# Altium project HAB-Altitude-Dynamics-Control-Card.PrjPcb (part 3 of 4)

## Sheet Power-Supplies.SchDoc: Payload Card 5V Rail Power Supplies
size A2; Revision: 1A; SheetNumber: 6; SheetTotal: 7; Organization: Brickworks; Address1: Matthew Glazer; Address2: Design Engineer
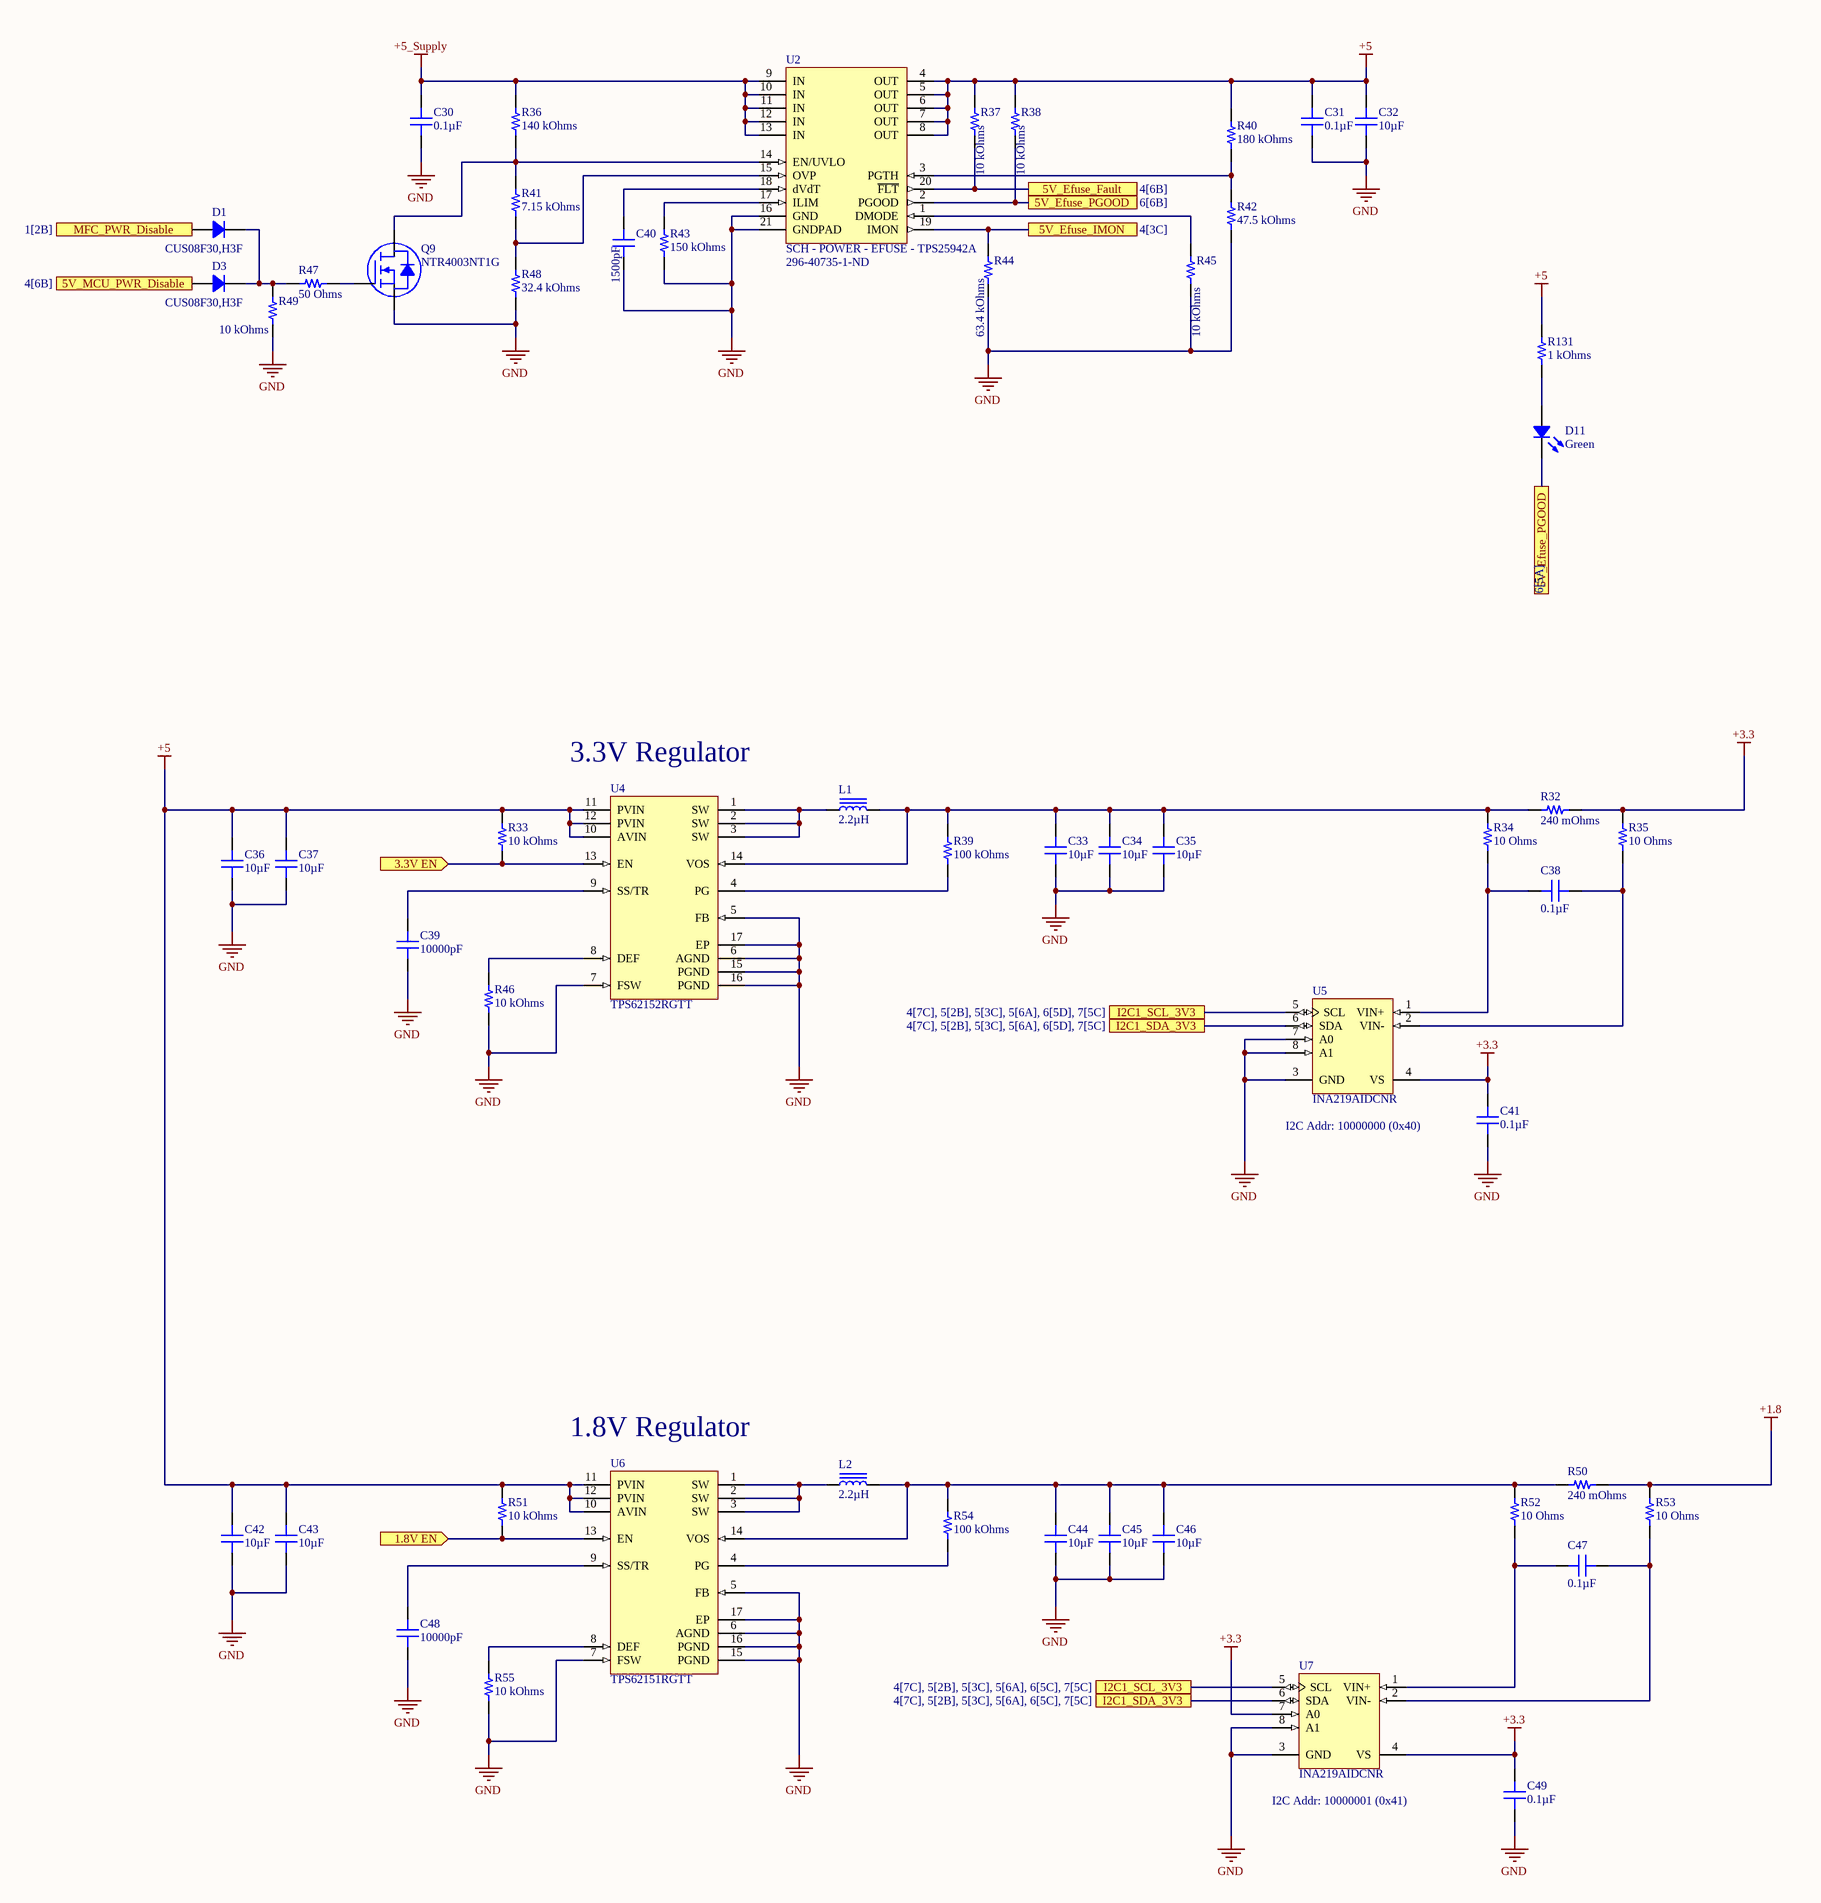
[diagram p5: Power-Supplies.SchDoc]

### Parts
C30  0.1µF  [CAP 0603_1608]
C31  0.1µF  [CAP 0603_1608]
C32  10µF  [CAP 0805_2012]
C33  10µF  [CAP 0805_2012]
C34  10µF  [CAP 0805_2012]
C35  10µF  [CAP 0805_2012]
C36  10µF  [CAP 0805_2012]
C37  10µF  [CAP 0805_2012]
C38  0.1µF  [CAP 0603_1608]
C39  10000pF  [CAP 0603_1608]
C40  1500pF  [CAP 0603_1608]
C41  0.1µF  [CAP 0603_1608]
C42  10µF  [CAP 0805_2012]
C43  10µF  [CAP 0805_2012]
C44  10µF  [CAP 0805_2012]
C45  10µF  [CAP 0805_2012]
C46  10µF  [CAP 0805_2012]
C47  0.1µF  [CAP 0603_1608]
C48  10000pF  [CAP 0603_1608]
C49  0.1µF  [CAP 0603_1608]
D1  CUS08F30,H3F  [SOD323]
D3  CUS08F30,H3F  [SOD323]
D11  Green  [LED 0603_1608 GREEN]
L1  2.2µH  [BOURNS SRN4018]
L2  2.2µH  [BOURNS SRN4018]
Q9  NTR4003NT1G  [ON SEMI SOT-23-3]
R32  240 mOhms  [RES 0805_2012]
R33  10 kOhms  [RES 0603_1608]
R34  10 Ohms  [RES 0603_1608]
R35  10 Ohms  [RES 0603_1608]
R36  140 kOhms  [RES 0603_1608]
R37  10 kOhms  [RES 0603_1608]
R38  10 kOhms  [RES 0603_1608]
R39  100 kOhms  [RES 0603_1608]
R40  180 kOhms  [RES 0603_1608]
R41  7.15 kOhms  [RES 0603_1608]
R42  47.5 kOhms  [RES 0603_1608]
R43  150 kOhms  [RES 0603_1608]
R44  63.4 kOhms  [RES 0603_1608]
R45  10 kOhms  [RES 0603_1608]
R46  10 kOhms  [RES 0603_1608]
R47  50 Ohms  [RES 0603_1608]
R48  32.4 kOhms  [RES 0603_1608]
R49  10 kOhms  [RES 0603_1608]
R50  240 mOhms  [RES 0805_2012]
R51  10 kOhms  [RES 0603_1608]
R52  10 Ohms  [RES 0603_1608]
R53  10 Ohms  [RES 0603_1608]
R54  100 kOhms  [RES 0603_1608]
R55  10 kOhms  [RES 0603_1608]
R131  1 kOhms  [RES 0603_1608]
U2  SCH - POWER - EFUSE - TPS25942A  Supplier Part Number 1: 296-40735-1-ND  [PCB - LEADLESS - QFN - TI 20-WQFN]
U4  TPS62152RGTT  [RGT0016C_V]
U5  INA219AIDCNR  [DCN0008A_M]
U6  TPS62151RGTT  [RGT0016C_V]
U7  INA219AIDCNR  [DCN0008A_M]

### Ports
1.8V EN (in), 3.3V EN (in), 5V_Efuse_Fault (see 4[6B]), 5V_Efuse_IMON (see 4[3C]), 5V_Efuse_PGOOD (see 6[5A]), 5V_Efuse_PGOOD (see 6[6B]), 5V_MCU_PWR_Disable (in, see 4[6B]), I2C1_SCL_3V3 (see 4[7C], 5[2B], 5[3C], 5[6A], 6[5C], 7[5C]), I2C1_SCL_3V3 (see 4[7C], 5[2B], 5[3C], 5[6A], 6[5D], 7[5C]), I2C1_SDA_3V3 (see 4[7C], 5[2B], 5[3C], 5[6A], 6[5C], 7[5C]), I2C1_SDA_3V3 (see 4[7C], 5[2B], 5[3C], 5[6A], 6[5D], 7[5C]), MFC_PWR_Disable (in, see 1[2B])

### Nets
+1.8: R50.2 R53.2
+3.3: C41.2 C49.2 R32.2 R35.2 U5.4(VS) U7.4(VS) U7.7(A0)
+5: C31.2 C32.2 C36.2 C37.2 C42.2 C43.2 R33.2 R37.2 R38.2 R40.2 R51.2 R131.1 U2.4(OUT) U2.5(OUT) U2.6(OUT) U2.7(OUT) U2.8(OUT) U4.10(AVIN) U4.11(PVIN) U4.12(PVIN) U6.10(AVIN) U6.11(PVIN) U6.12(PVIN)
+5_Supply: C30.2 R36.2 U2.9(IN) U2.10(IN) U2.11(IN) U2.12(IN) U2.13(IN)
GND: C30.1 C31.1 C32.1 C33.1 C34.1 C35.1 C36.1 C37.1 C39.1 C40.1 C41.1 C42.1 C43.1 C44.1 C45.1 C46.1 C48.1 C49.1 Q9.2(S) R42.1 R43.1 R44.1 R45.1 R46.1 R48.1 R49.1 R55.1 U2.16(GND) U2.21(GNDPAD) U4.5(FB) U4.6(AGND) U4.7(FSW) U4.15(PGND) U4.16(PGND) U4.17(EP) U5.3(GND) U5.7(A0) U5.8(A1) U6.5(FB) U6.6(AGND) U6.7(FSW) U6.15(PGND) U6.16(PGND) U6.17(EP) U7.3(GND) U7.8(A1)
NetC33_2: C33.2 C34.2 C35.2 L1.2 R32.1 R34.2 R39.2 U4.14(VOS)
NetC38_1: C38.1 R35.1 U5.2(VIN-)
NetC38_2: C38.2 R34.1 U5.1(VIN+)
NetC39_2: C39.2 U4.9(SS/TR)
NetC40_2: C40.2 U2.18(dVdT)
NetC44_2: C44.2 C45.2 C46.2 L2.2 R50.1 R52.2 R54.2 U6.14(VOS)
NetC47_1: C47.1 R53.1 U7.2(VIN-)
NetC47_2: C47.2 R52.1 U7.1(VIN+)
NetC48_2: C48.2 U6.9(SS/TR)
NetD1_1: D1.1 ; port MFC_PWR_Disable
NetD1_2: D1.2 D3.2 R47.2 R49.2
NetD3_1: D3.1 ; port 5V_MCU_PWR_Disable
NetD11_1: D11.1 R131.2
NetD11_2: D11.2 R38.1 U2.2(PGOOD) ; port 5V_Efuse_PGOOD
NetL1_1: L1.1 U4.1(SW) U4.2(SW) U4.3(SW)
NetL2_1: L2.1 U6.1(SW) U6.2(SW) U6.3(SW)
NetQ9_1: Q9.1(G) R47.1
NetQ9_3: Q9.3(D) R36.1 R41.2 U2.14(EN/UVLO)
NetR29_1: U5.5(SCL) U7.5(SCL) ; port I2C1_SCL_3V3
NetR30_1: U5.6(SDA) U7.6(SDA) ; port I2C1_SDA_3V3
NetR33_1: R33.1 U4.13(EN) ; port 3.3V EN
NetR37_1: R37.1 U2.20(~{FLT}) ; port 5V_Efuse_Fault
NetR39_1: R39.1 U4.4(PG)
NetR40_1: R40.1 R42.2 U2.3(PGTH)
NetR41_1: R41.1 R48.2 U2.15(OVP)
NetR43_2: R43.2 U2.17(ILIM)
NetR44_2: R44.2 U2.19(IMON) ; port 5V_Efuse_IMON
NetR45_2: R45.2 U2.1(DMODE)
NetR46_2: R46.2 U4.8(DEF)
NetR51_1: R51.1 U6.13(EN) ; port 1.8V EN
NetR54_1: R54.1 U6.4(PG)
NetR55_2: R55.2 U6.8(DEF)

### Notes on the sheet
- (near U4) 3.3V Regulator
- I2C Addr: 10000000 (0x40)
- (near U6) 1.8V Regulator
- (near U7) I2C Addr: 10000001 (0x41)
- Title
- Size:
- Date:
- File:
- A2
- Number:
- Time:
- Revision:
- Sheet
- of

### Library data of the parts
C30 C31 C38 C41 C47 C49 = CL10B104KA8WPNC: CAP CER 0.1UF 25V X7R 0603; Manufacturer: Samsung Electro-Mechanics; Tolerance: ±10%; Part Number: CL10B104KA8WPNC; Value: 0.1µF; Applications: Automotive; Capacitance: 0.1µF; ComponentLink1Description: Datasheet; ComponentLink1URL: http://www.samsungsem.com/kr/support/product-search/mlcc/CL10B104KA8WPNC.jsp; ComponentLink2Description: DigiKey Link; ComponentLink2URL: http://digikey.com/product-detail/en/samsung-electro-mechanics/CL10B104KA8WPNC/1276-6717-1-ND/5961576; Device Package: 0603 (1608 Metric); Features: Open Mode; LastUpdated: 9/2/2020 1:03:30 AM; Lifecycle Status: Active; Minimum Order: 1; Mounting Type: Surface Mount, MLCC; Operating Temperature: -55°C ~ 125°C; Package / Case: 0603 (1608 Metric); Packaging: TapeAndReel; PartId: 5631; Part Status: Active; Price: 0.02; Ratings: AEC-Q200; Series: CL; Size / Dimension: 0.063" L x 0.031" W (1.60mm x 0.80mm); Supplier 1: DigiKey; Supplier Part Number 1: 1276-6717-1-ND; Temperature Coefficient: X7R; Thickness (Max): 0.035" (0.90mm); Voltage - Rated: 25V
C32-C37 C42-C46 = CC0805KKX5R7BB106: CAP CER 10UF 16V X5R 0805; Manufacturer: Yageo; Tolerance: ±10%; Part Number: CC0805KKX5R7BB106; Value: 10µF; Applications: General Purpose; Capacitance: 10µF; ComponentLink1Description: Datasheet; ComponentLink1URL: https://www.yageo.com/upload/media/product/productsearch/datasheet/mlcc/UPY-GPHC_X5R_4V-to-50V_25.pdf; ComponentLink2Description: DigiKey Link; ComponentLink2URL: http://digikey.com/product-detail/en/yageo/CC0805KKX5R7BB106/311-1865-1-ND/5195767; Device Package: 0805 (2012 Metric); LastUpdated: 9/2/2020 1:04:30 AM; Lifecycle Status: Active; Minimum Order: 1; Mounting Type: Surface Mount, MLCC; Operating Temperature: -55°C ~ 85°C; Package / Case: 0805 (2012 Metric); Packaging: TapeAndReel; PartId: 8867; Part Status: Active; Price: 0.09; Series: CC; Size / Dimension: 0.079" L x 0.049" W (2.00mm x 1.25mm); Supplier 1: DigiKey; Supplier Part Number 1: 311-1865-1-ND; Temperature Coefficient: X5R; Thickness (Max): 0.057" (1.45mm); Voltage - Rated: 16V
C39 C48 = C0603S103K4RACTU: CAP CER 10000PF 16V X7R 0603; Manufacturer: KEMET; Tolerance: ±10%; Part Number: C0603S103K4RACTU; Value: 10000pF; Applications: Boardflex Sensitive; Capacitance: 10000pF; ComponentLink1Description: Datasheet; ComponentLink1URL: https://api.kemet.com/component-edge/download/datasheet/C0603S103K4RACTU.pdf; ComponentLink2Description: DigiKey Link; ComponentLink2URL: http://digikey.com/product-detail/en/kemet/C0603S103K4RACTU/399-9135-1-ND/3522653; Device Package: 0603 (1608 Metric); Features: Floating Electrode; LastUpdated: 9/2/2020 1:03:34 AM; Lifecycle Status: Active; Minimum Order: 1; Mounting Type: Surface Mount, MLCC; Operating Temperature: -55°C ~ 125°C; Package / Case: 0603 (1608 Metric); Packaging: TapeAndReel; PartId: 3312; Part Status: Active; Price: 0.07; Series: SMD Comm X7R FE; Size / Dimension: 0.063" L x 0.031" W (1.60mm x 0.80mm); Supplier 1: DigiKey; Supplier Part Number 1: 399-9135-1-ND; Temperature Coefficient: X7R; Thickness (Max): 0.034" (0.87mm); Voltage - Rated: 16V
C40 = CC0603JRX7R8BB152: CAP CER 1500PF 25V X7R 0603; Manufacturer: Yageo; Tolerance: ±5%; Part Number: CC0603JRX7R8BB152; Value: 1500pF; Applications: General Purpose; Capacitance: 1500pF; ComponentLink1Description: Datasheet; ComponentLink1URL: https://www.yageo.com/upload/media/product/productsearch/datasheet/mlcc/UPY-GPHC_X7R_6.3V-to-50V_18.pdf; ComponentLink2Description: DigiKey Link; ComponentLink2URL: http://digikey.com/product-detail/en/yageo/CC0603JRX7R8BB152/311-3996-1-ND/8025085; Device Package: 0603 (1608 Metric); LastUpdated: 9/2/2020 1:03:18 AM; Lifecycle Status: Active; Minimum Order: 1; Mounting Type: Surface Mount, MLCC; Operating Temperature: -55°C ~ 125°C; Package / Case: 0603 (1608 Metric); Packaging: TapeAndReel; PartId: 12307; Part Status: Active; Price: 0.02; Series: CC; Size / Dimension: 0.063" L x 0.031" W (1.60mm x 0.80mm); Supplier 1: DigiKey; Supplier Part Number 1: 311-3996-1-ND; Temperature Coefficient: X7R; Thickness (Max): 0.035" (0.90mm); Voltage - Rated: 25V
D1 D3 = CUS08F30,H3F: DIODE SCHOTTKY 30V 800MA USC; Manufacturer: Toshiba Semiconductor and Storage; Current - Reverse Leakage @ Vr: 50µA @ 30V; Speed: Fast Recovery =< 500ns, > 200mA (Io); Voltage - Forward (Vf) (Max) @ If: 220mV @ 10mA; Part Number: CUS08F30,H3F; ComponentLink1Description: Datasheet; ComponentLink1URL: https://toshiba.semicon-storage.com/info/docget.jsp?did=9019&prodName=CUS08F30; ComponentLink2Description: DigiKey Link; ComponentLink2URL: http://digikey.com/product-detail/en/toshiba-semiconductor-and-storage/CUS08F30H3F/CUS08F30H3FCT-ND/5114376; Current - Average Rectified (Io): 800mA; Diode Type: Schottky; LastUpdated: 9/2/2020 1:27:26 AM; Lifecycle Status: Active; Minimum Order: 1; Mounting Type: Surface Mount; Operating Temperature - Junction: 125°C (Max); Package / Case: SC-76, SOD-323; Packaging: TapeAndReel; PartId: 3013; Part Status: Active; Price: 0.06; Series: -; Supplier 1: DigiKey; Supplier Part Number 1: CUS08F30H3FCT-ND; Supplier Device Package: USC; Voltage - DC Reverse (Vr) (Max): 30V
D11 = LTST-C193KGKT-5A: LED GREEN CLEAR CHIP SMD; Manufacturer: Lite-On Inc.; Configuration: Standard; Current - Test: 5mA; Lens Color: Colorless; Lens Size: 1.15mm x 0.80mm; Lens Style: Rectangle with Flat Top; Millicandela Rating: 16.25mcd; Viewing Angle: 130°; Voltage - Forward (Vf) (Typ): 2V; Wavelength - Dominant: 572nm; Wavelength - Peak: 574nm; Part Number: LTST-C193KGKT-5A; Color: Green; ComponentLink1Description: Datasheet; ComponentLink1URL: http://optoelectronics.liteon.com/upload/download/DS22-2007-0094/LTST-C193KGKT-5A.PDF; ComponentLink2Description: DigiKey Link; ComponentLink2URL: http://digikey.com/product-detail/en/lite-on-inc/LTST-C193KGKT-5A/160-1828-1-ND/2356247; Device Package: 0603 (1608 Metric); Height (Max): 0.45mm; LastUpdated: 9/2/2020 1:20:41 AM; Lens Transparency: Clear; Lifecycle Status: Active; Minimum Order: 1; Mounting Type: Surface Mount; Package / Case: 0603 (1608 Metric); Packaging: TapeAndReel; PartId: 694; Part Status: Active; Price: 0.06; Series: -; Size / Dimension: 1.60mm L x 0.80mm W; Supplier 1: DigiKey; Supplier Part Number 1: 160-1828-1-ND; Supplier Device Package: Chip LED; Value: Green
L1 L2 = SRN4018-2R2M: FIXED IND 2.2UH 2.9A 44 MOHM SMD; Manufacturer: Bourns Inc.; Current - Saturation: 3A; DC Resistance (DCR): 44mOhm Max; Frequency - Self Resonant: 60MHz; Inductance Frequency - Test: 100kHz; Material - Core: Ferrite; Q @ Freq: 9 @ 7.96MHz; Shielding: Semi-Shielded; Tolerance: ±20%; Type: Wirewound; Part Number: SRN4018-2R2M; ComponentLink1Description: Datasheet; ComponentLink1URL: https://www.bourns.com/docs/Product-Datasheets/SRN4018.pdf; ComponentLink2Description: DigiKey Link; ComponentLink2URL: http://digikey.com/product-detail/en/bourns-inc/SRN4018-2R2M/SRN4018-2R2MCT-ND/3821517; Current Rating (Amps): 2.9A; Device Package: Nonstandard; Height - Seated (Max): 0.071" (1.80mm); Inductance: 2.2µH; LastUpdated: 9/2/2020 1:30:23 AM; Lifecycle Status: Active; Minimum Order: 1; Mounting Type: Surface Mount; Operating Temperature: -40°C ~ 125°C; Package / Case: Nonstandard; Packaging: TapeAndReel; PartId: 3660; Part Status: Active; Price: 0.16; Series: SRN4018; Size / Dimension: 0.157" L x 0.157" W (4.00mm x 4.00mm); Supplier 1: DigiKey; Supplier Part Number 1: SRN4018-2R2MCT-ND; Value: 2.2µH
Q9 = NTR4003NT1G: MOSFET N-CH 30V 500MA SOT-23; Manufacturer: ON Semiconductor; Current - Continuous Drain (Id) @ 25°C: 500mA (Ta); Drive Voltage (Max Rds On,  Min Rds On): 2.5V, 4V; FET Type: N-Channel; Gate Charge (Qg) (Max) @ Vgs: 1.15nC @ 5V; Input Capacitance (Ciss) (Max) @ Vds: 21pF @ 5V; Power Dissipation (Max): 690mW (Ta); Rds On (Max) @ Id, Vgs: 1.5Ohm @ 10mA, 4V; Vgs (Max): ±20V; Vgs(th) (Max) @ Id: 1.4V @ 250µA; Part Number: NTR4003NT1G; ComponentLink1Description: Datasheet; ComponentLink1URL: http://www.onsemi.com/pub/Collateral/NTR4003N-D.PDF; ComponentLink2Description: DigiKey Link; ComponentLink2URL: http://digikey.com/product-detail/en/on-semiconductor/NTR4003NT1G/NTR4003NT1GOSCT-ND/1967270; Drain to Source Voltage (Vdss): 30V; LastUpdated: 9/2/2020 1:25:08 AM; Lifecycle Status: Active; Minimum Order: 1; Mounting Type: Surface Mount; Operating Temperature: -55°C ~ 150°C (TJ); Package / Case: TO-236-3, SC-59, SOT-23-3; Packaging: TapeAndReel; Part Status: Active; Price: 0.05; Series: -; Supplier 1: DigiKey; Supplier Part Number 1: NTR4003NT1GOSCT-ND; Supplier Device Package: SOT-23-3 (TO-236); Technology: MOSFET (Metal Oxide)
R32 R50 = ERJ-6DQFR24V: RES 0.24 OHM 1% 1/2W 0805; Manufacturer: Panasonic Electronic Components; Power (Watts): 0.5W, 1/2W; Temperature Coefficient: ±100ppm/°C; Part Number: ERJ-6DQFR24V; Value: 240 mOhms; ComponentLink1Description: Datasheet; ComponentLink1URL: https://industrial.panasonic.com/cdbs/www-data/pdf/RDN0000/AOA0000C313.pdf; ComponentLink2Description: DigiKey Link; ComponentLink2URL: http://digikey.com/product-detail/en/panasonic-electronic-components/ERJ-6DQFR24V/P19293CT-ND/6004648; Composition: Thick Film; Device Package: 0805 (2012 Metric); Features: Automotive AEC-Q200, Current Sense; Height - Seated (Max): 0.028" (0.70mm); LastUpdated: 9/2/2020 1:14:59 AM; Lifecycle Status: Active; Minimum Order: 1; Number of Terminations: 2; Operating Temperature: -55°C ~ 155°C; Package / Case: 0805 (2012 Metric); Packaging: TapeAndReel; PartId: 39224; Part Status: Active; Price: 0.04; Ratings: AEC-Q200; Resistance: 240 mOhms; Series: ERJ; Size / Dimension: 0.079" L x 0.049" W (2.00mm x 1.25mm); Supplier 1: DigiKey; Supplier Part Number 1: P19293CT-ND; Supplier Device Package: 0805; Tolerance: ±1%
R33 R37 R38 R45 R46 R49 R51 R55 = RMCF0603JT10K0: RES 10K OHM 5% 1/10W 0603; Manufacturer: Stackpole Electronics Inc; Power (Watts): 0.1W, 1/10W; Temperature Coefficient: ±200ppm/°C; Part Number: RMCF0603JT10K0; Value: 10 kOhms; ComponentLink1Description: Datasheet; ComponentLink1URL: https://www.seielect.com/catalog/sei-packaging.pdf; ComponentLink2Description: DigiKey Link; ComponentLink2URL: http://digikey.com/product-detail/en/stackpole-electronics-inc/RMCF0603JT10K0/RMCF0603JT10K0CT-ND/1943191; Composition: Thick Film; Device Package: 0603 (1608 Metric); Features: Automotive AEC-Q200; Height - Seated (Max): 0.022" (0.55mm); LastUpdated: 8/30/2020 8:48:45 PM; Lifecycle Status: Active; Minimum Order: 1; Number of Terminations: 2; Operating Temperature: -55°C ~ 155°C; Package / Case: 0603 (1608 Metric); Packaging: CutTape; PartId: 25659; Part Status: Active; Price: 0.10; Ratings: AEC-Q200; Resistance: 10 kOhms; Series: RMCF; Size / Dimension: 0.061" L x 0.031" W (1.55mm x 0.80mm); Supplier 1: DigiKey; Supplier Part Number 1: RMCF0603JT10K0CT-ND; Supplier Device Package: 0603; Tolerance: ±5%
R34 R35 R52 R53 = CRGCQ0603F10R: CRGCQ 0603 10R 1%; Manufacturer: TE Connectivity Passive Product; Power (Watts): 0.1W, 1/10W; Temperature Coefficient: ±400ppm/°C; Part Number: CRGCQ0603F10R; Value: 10 Ohms; ComponentLink1Description: Datasheet; ComponentLink1URL: https://www.te.com/commerce/DocumentDelivery/DDEController?Action=srchrtrv&DocNm=1773204-3&DocType=DS&DocLang=English; ComponentLink2Description: DigiKey Link; ComponentLink2URL: http://digikey.com/product-detail/en/te-connectivity-passive-product/CRGCQ0603F10R/A129664CT-ND/8577496; Composition: Thick Film; Device Package: 0603 (1608 Metric); Features: Automotive AEC-Q200, Moisture Resistant; Height - Seated (Max): 0.022" (0.55mm); LastUpdated: 9/2/2020 1:09:39 AM; Lifecycle Status: Active; Minimum Order: 1; Number of Terminations: 2; Operating Temperature: -55°C ~ 155°C; Package / Case: 0603 (1608 Metric); Packaging: CutTape; PartId: 23975; Part Status: Active; Price: 0.10; Ratings: AEC-Q200; Resistance: 10 Ohms; Series: CRGCQ; Size / Dimension: 0.063" L x 0.031" W (1.60mm x 0.80mm); Supplier 1: DigiKey; Supplier Part Number 1: A129664CT-ND; Supplier Device Package: 0603; Tolerance: ±1%
R36 = RT0603BRE07140KL: RES SMD 140K OHM 0.1% 1/10W 0603; Manufacturer: Yageo; Power (Watts): 0.1W, 1/10W; Temperature Coefficient: ±50ppm/°C; Part Number: RT0603BRE07140KL; Value: 140 kOhms; ComponentLink1Description: Datasheet; ComponentLink1URL: https://www.yageo.com/upload/media/product/productsearch/datasheet/rchip/PYu-RT_1-to-0.01_RoHS_L_11.pdf; ComponentLink2Description: DigiKey Link; ComponentLink2URL: http://digikey.com/product-detail/en/yageo/RT0603BRE07140KL/YAG4626CT-ND/6616782; Composition: Thin Film; Device Package: 0603 (1608 Metric); Height - Seated (Max): 0.022" (0.55mm); LastUpdated: 9/2/2020 1:09:47 AM; Lifecycle Status: Active; Minimum Order: 1; Number of Terminations: 2; Operating Temperature: -55°C ~ 155°C; Package / Case: 0603 (1608 Metric); Packaging: TapeAndReel; PartId: 22168; Part Status: Active; Price: 0.05; Resistance: 140 kOhms; Series: RT; Size / Dimension: 0.063" L x 0.031" W (1.60mm x 0.80mm); Supplier 1: DigiKey; Supplier Part Number 1: YAG4626CT-ND; Supplier Device Package: 0603; Tolerance: ±0.1%
R39 R54 = RC0603JR-10100KL: RES SMD 100K OHM 5% 1/10W 0603; Manufacturer: Yageo; Power (Watts): 0.1W, 1/10W; Temperature Coefficient: ±100ppm/°C; Part Number: RC0603JR-10100KL; Value: 100 kOhms; ComponentLink1Description: Datasheet; ComponentLink1URL: https://www.yageo.com/upload/media/product/productsearch/datasheet/rchip/PYu-RC_Group_51_RoHS_L_10.pdf; ComponentLink2Description: DigiKey Link; ComponentLink2URL: http://digikey.com/product-detail/en/yageo/RC0603JR-10100KL/YAG2294CT-ND/5252408; Composition: Thick Film; Device Package: 0603 (1608 Metric); Features: Moisture Resistant; Height - Seated (Max): 0.022" (0.55mm); LastUpdated: 9/2/2020 1:10:22 AM; Lifecycle Status: Active; Minimum Order: 1; Number of Terminations: 2; Operating Temperature: -55°C ~ 155°C; Package / Case: 0603 (1608 Metric); Packaging: CutTape; PartId: 6071; Part Status: Active; Price: 0.10; Resistance: 100 kOhms; Series: RC; Size / Dimension: 0.063" L x 0.031" W (1.60mm x 0.80mm); Supplier 1: DigiKey; Supplier Part Number 1: YAG2294CT-ND; Supplier Device Package: 0603; Tolerance: ±5%
R40 = RMCF0603FT180K: RES 180K OHM 1% 1/10W 0603; Manufacturer: Stackpole Electronics Inc; Power (Watts): 0.1W, 1/10W; Temperature Coefficient: ±100ppm/°C; Part Number: RMCF0603FT180K; Value: 180 kOhms; ComponentLink1Description: Datasheet; ComponentLink1URL: https://www.seielect.com/catalog/sei-rmcf_rmcp.pdf; ComponentLink2Description: DigiKey Link; ComponentLink2URL: http://digikey.com/product-detail/en/stackpole-electronics-inc/RMCF0603FT180K/RMCF0603FT180KCT-ND/5049744; Composition: Thick Film; Device Package: 0603 (1608 Metric); Features: Automotive AEC-Q200; Height - Seated (Max): 0.022" (0.55mm); LastUpdated: 9/2/2020 1:10:00 AM; Lifecycle Status: Active; Minimum Order: 1; Number of Terminations: 2; Operating Temperature: -55°C ~ 155°C; Package / Case: 0603 (1608 Metric); Packaging: CutTape; PartId: 16499; Part Status: Active; Price: 0.10; Ratings: AEC-Q200; Resistance: 180 kOhms; Series: RMCF; Size / Dimension: 0.061" L x 0.031" W (1.55mm x 0.80mm); Supplier 1: DigiKey; Supplier Part Number 1: RMCF0603FT180KCT-ND; Supplier Device Package: 0603; Tolerance: ±1%
R41 = ERJ-PB3B7151V: RES SMD 7.15K OHM 0.1% 1/5W 0603; Manufacturer: Panasonic Electronic Components; Power (Watts): 0.2W, 1/5W; Temperature Coefficient: ±50ppm/°C; Part Number: ERJ-PB3B7151V; Value: 7.15 kOhms; ComponentLink1Description: Datasheet; ComponentLink1URL: https://industrial.panasonic.com/cdbs/www-data/pdf/RDM0000/AOA0000C328.pdf; ComponentLink2Description: DigiKey Link; ComponentLink2URL: http://digikey.com/product-detail/en/panasonic-electronic-components/ERJ-PB3B7151V/P20070CT-ND/6214325; Composition: Thick Film; Device Package: 0603 (1608 Metric); Features: Automotive AEC-Q200, Pulse Withstanding; Height - Seated (Max): 0.022" (0.55mm); LastUpdated: 9/2/2020 1:10:22 AM; Lifecycle Status: Active; Minimum Order: 1; Number of Terminations: 2; Operating Temperature: -55°C ~ 155°C; Package / Case: 0603 (1608 Metric); Packaging: TapeAndReel; PartId: 6380; Part Status: Active; Price: 0.03; Ratings: AEC-Q200; Resistance: 7.15 kOhms; Series: ERJ; Size / Dimension: 0.063" L x 0.031" W (1.60mm x 0.80mm); Supplier 1: DigiKey; Supplier Part Number 1: P20070CT-ND; Supplier Device Package: 0603; Tolerance: ±0.1%
R42 = RMCF0603FG47K5: RES 47.5K OHM 1% 1/10W 0603; Manufacturer: Stackpole Electronics Inc; Power (Watts): 0.1W, 1/10W; Temperature Coefficient: ±100ppm/°C; Part Number: RMCF0603FG47K5; Value: 47.5 kOhms; ComponentLink1Description: Datasheet; ComponentLink1URL: https://www.seielect.com/catalog/sei-packaging.pdf; ComponentLink2Description: DigiKey Link; ComponentLink2URL: http://digikey.com/product-detail/en/stackpole-electronics-inc/RMCF0603FG47K5/RMCF0603FG47K5CT-ND/4425046; Composition: Thick Film; Device Package: 0603 (1608 Metric); Features: Automotive AEC-Q200; Height - Seated (Max): 0.022" (0.55mm); LastUpdated: 9/2/2020 1:09:32 AM; Lifecycle Status: Active; Minimum Order: 1; Number of Terminations: 2; Operating Temperature: -55°C ~ 155°C; Package / Case: 0603 (1608 Metric); Packaging: CutTape; PartId: 25458; Part Status: Active; Price: 0.10; Ratings: AEC-Q200; Resistance: 47.5 kOhms; Series: RMCF; Size / Dimension: 0.061" L x 0.031" W (1.55mm x 0.80mm); Supplier 1: DigiKey; Supplier Part Number 1: RMCF0603FG47K5CT-ND; Supplier Device Package: 0603; Tolerance: ±1%
R43 = RMCF0603FG150K: RES 150K OHM 1% 1/10W 0603; Manufacturer: Stackpole Electronics Inc; Power (Watts): 0.1W, 1/10W; Temperature Coefficient: ±100ppm/°C; Part Number: RMCF0603FG150K; Value: 150 kOhms; ComponentLink1Description: Datasheet; ComponentLink1URL: https://www.seielect.com/catalog/sei-rmcf_rmcp.pdf; ComponentLink2Description: DigiKey Link; ComponentLink2URL: http://digikey.com/product-detail/en/stackpole-electronics-inc/RMCF0603FG150K/RMCF0603FG150KCT-ND/4425034; Composition: Thick Film; Device Package: 0603 (1608 Metric); Features: Automotive AEC-Q200; Height - Seated (Max): 0.022" (0.55mm); LastUpdated: 9/2/2020 1:10:05 AM; Lifecycle Status: Active; Minimum Order: 1; Number of Terminations: 2; Operating Temperature: -55°C ~ 155°C; Package / Case: 0603 (1608 Metric); Packaging: CutTape; PartId: 13982; Part Status: Active; Price: 0.10; Ratings: AEC-Q200; Resistance: 150 kOhms; Series: RMCF; Size / Dimension: 0.061" L x 0.031" W (1.55mm x 0.80mm); Supplier 1: DigiKey; Supplier Part Number 1: RMCF0603FG150KCT-ND; Supplier Device Package: 0603; Tolerance: ±1%
R44 = RMCF0603FT63K4: RES 63.4K OHM 1% 1/10W 0603; Manufacturer: Stackpole Electronics Inc; Power (Watts): 0.1W, 1/10W; Temperature Coefficient: ±100ppm/°C; Part Number: RMCF0603FT63K4; Value: 63.4 kOhms; ComponentLink1Description: Datasheet; ComponentLink1URL: https://www.seielect.com/catalog/sei-rmcf_rmcp.pdf; ComponentLink2Description: DigiKey Link; ComponentLink2URL: http://digikey.com/product-detail/en/stackpole-electronics-inc/RMCF0603FT63K4/RMCF0603FT63K4CT-ND/2418113; Composition: Thick Film; Device Package: 0603 (1608 Metric); Features: Automotive AEC-Q200; Height - Seated (Max): 0.022" (0.55mm); LastUpdated: 9/2/2020 1:10:16 AM; Lifecycle Status: Active; Minimum Order: 1; Number of Terminations: 2; Operating Temperature: -55°C ~ 155°C; Package / Case: 0603 (1608 Metric); Packaging: CutTape; PartId: 8895; Part Status: Active; Price: 0.10; Ratings: AEC-Q200; Resistance: 63.4 kOhms; Series: RMCF; Size / Dimension: 0.061" L x 0.031" W (1.55mm x 0.80mm); Supplier 1: DigiKey; Supplier Part Number 1: RMCF0603FT63K4CT-ND; Supplier Device Package: 0603; Tolerance: ±1%
R47 = CRCW060350R0FKEA: RES SMD 50 OHM 1% 1/10W 0603; Manufacturer: Vishay Dale; Power (Watts): 0.1W, 1/10W; Temperature Coefficient: ±100ppm/°C; Part Number: CRCW060350R0FKEA; Value: 50 Ohms; ComponentLink1Description: Datasheet; ComponentLink1URL: http://www.vishay.com/docs/20035/dcrcwe3.pdf; ComponentLink2Description: DigiKey Link; ComponentLink2URL: http://digikey.com/product-detail/en/vishay-dale/CRCW060350R0FKEA/541-3318-1-ND/6684924; Composition: Thick Film; Device Package: 0603 (1608 Metric); Features: Automotive AEC-Q200; Height - Seated (Max): 0.020" (0.50mm); LastUpdated: 9/2/2020 1:09:40 AM; Lifecycle Status: Active; Minimum Order: 1; Number of Terminations: 2; Operating Temperature: -55°C ~ 155°C; Package / Case: 0603 (1608 Metric); Packaging: CutTape; PartId: 23780; Part Status: Active; Price: 0.10; Ratings: AEC-Q200; Resistance: 50 Ohms; Series: CRCW; Size / Dimension: 0.061" L x 0.033" W (1.55mm x 0.85mm); Supplier 1: DigiKey; Supplier Part Number 1: 541-3318-1-ND; Supplier Device Package: 0603; Tolerance: ±1%
R48 = ERJ-PB3B3242V: RES SMD 32.4K OHM 0.1% 1/5W 0603; Manufacturer: Panasonic Electronic Components; Power (Watts): 0.2W, 1/5W; Temperature Coefficient: ±50ppm/°C; Part Number: ERJ-PB3B3242V; Value: 32.4 kOhms; ComponentLink1Description: Datasheet; ComponentLink1URL: https://industrial.panasonic.com/cdbs/www-data/pdf/RDM0000/AOA0000C328.pdf; ComponentLink2Description: DigiKey Link; ComponentLink2URL: http://digikey.com/product-detail/en/panasonic-electronic-components/ERJ-PB3B3242V/P20142CT-ND/6214397; Composition: Thick Film; Device Package: 0603 (1608 Metric); Features: Automotive AEC-Q200, Pulse Withstanding; Height - Seated (Max): 0.022" (0.55mm); LastUpdated: 9/2/2020 1:10:06 AM; Lifecycle Status: Active; Minimum Order: 1; Number of Terminations: 2; Operating Temperature: -55°C ~ 155°C; Package / Case: 0603 (1608 Metric); Packaging: TapeAndReel; PartId: 13586; Part Status: Active; Price: 0.03; Ratings: AEC-Q200; Resistance: 32.4 kOhms; Series: ERJ; Size / Dimension: 0.063" L x 0.031" W (1.60mm x 0.80mm); Supplier 1: DigiKey; Supplier Part Number 1: P20142CT-ND; Supplier Device Package: 0603; Tolerance: ±0.1%
R131 = RNCP0603FTD1K00: RES 1K OHM 1% 1/8W 0603; Manufacturer: Stackpole Electronics Inc; Power (Watts): 0.125W, 1/8W; Temperature Coefficient: ±100ppm/°C; Part Number: RNCP0603FTD1K00; Value: 1 kOhms; ComponentLink1Description: Datasheet; ComponentLink1URL: https://www.seielect.com/catalog/sei-rncp.pdf; ComponentLink2Description: DigiKey Link; ComponentLink2URL: http://digikey.com/product-detail/en/stackpole-electronics-inc/RNCP0603FTD1K00/RNCP0603FTD1K00CT-ND/2240445; Composition: Thin Film; Device Package: 0603 (1608 Metric); Features: Anti-Sulfur, Moisture Resistant; Height - Seated (Max): 0.020" (0.50mm); LastUpdated: 9/2/2020 1:10:23 AM; Lifecycle Status: Active; Minimum Order: 1; Number of Terminations: 2; Operating Temperature: -55°C ~ 155°C; Package / Case: 0603 (1608 Metric); Packaging: TapeAndReel; PartId: 5694; Part Status: Active; Price: 0.01; Resistance: 1 kOhms; Series: RNCP; Size / Dimension: 0.059" L x 0.031" W (1.50mm x 0.80mm); Supplier 1: DigiKey; Supplier Part Number 1: RNCP0603FTD1K00CT-ND; Supplier Device Package: 0603; Tolerance: ±1%
U4 = CMP-0323-00129-3: Buck Step Down Regulator with 3 to 17 V Input and 3.3 V Output, -40 to 85 degC, 16-Pin QFN (RGT), Green (RoHS & no Sb/Br); Manufacturer: Texas Instruments; Rating: Catalog; Duty Cycle(Max)(%): 100; Regulated Outputs(#): 1; Preset Vout(V): 3.3; Vin(Max)(V): 17; Switch Current Limit(Typ)(A): 1.7; SubFamily: Step-Down Regulator; Iq(Typ)(mA): 0.017; Vin(Min)(V): 3; Synchronous Rectification: TRUE; PackageVersion: revH, Oct-2011; ComponentLink2Description: Package Specification; Code_JEDEC: MO-220; ComponentLink1Description: Datasheet; PackageDescription: 16-Pin Plastic Quad Flat No-Lead, 3 x 3 mm Body, 0.5 mm Pitch, 1.7 x 1.7 mm Exposed Pad; Iout(Max)(A): 1; Eco-Plan: Green (RoHS & no Sb/Br); PartNumber: TPS62152RGTT; Vout(Max)(V): 3.3; Topology: Buck; ComponentLink3URL: Samples URL:http://www.ti.com/product/tps54611#samples; ComponentLink2URL: http://www.ti.com/litv/pdf/mpqf119g; ComponentLink3Description: URL Link1; ComponentLink1URL: http://www.ti.com/general/docs/lit/getliterature.tsp?genericPartNumber=TPS62152&fileType=pdf; Vout(Min)(V): 3.3; Mounting Technology: Surface Mount; DatasheetVersion: SLVSAL5; PackageReference: RGT0016C
U5 U7 = CMP-0704-00041-2: Zero-Drift, Bi-directional Current / Power Monitor, 3 to 5.5 V, -40 to 125 degC, 8-pin SOP (DCN8), Green (RoHS & no Sb/Br); Manufacturer: Texas Instruments; Input Offset (+/-)(Max)(uV): 100; Small-Signal Bandwidth(Typ)(MHz): 0.011; SubFamily: Current Shunt Monitor; Rating: Catalog; Quiescent Current (+/-)(Typ)(mA): 0.7; Vs(Max)(V): 5.5; Common Mode Range(Min)(V): 0; Vs(Min)(V): 3; Common Mode Range(Max)(V): 26; Gain(V/V): 1, 0.5, 0.25, 0.125; ComponentLink3URL: http://www.ti.com/lit/ml/mpds099c/mpds099c.pdf; ComponentLink2URL: http://www.ti.com/general/docs/lit/getliterature.tsp?genericPartNumber=INA219&fileType=pdf; PackageReference: DCN0008A; ComponentLink1URL: http://www.ti.com/; ComponentLink1Description: Manufacturer URL; Code_JEDEC: MO-178; CMRR(Min)(dB): 100; DatasheetVersion: SBOS448F; Mounting Technology: Surface Mount; ComponentLink3Description: Package Specification; PartNumber: INA219AIDCNR; PackageVersion: 4202106/D, 11/2009; Eco-Plan: Green (RoHS & no Sb/Br); ComponentLink2Description: Datasheet; PackageDescription: 8-Pin Plastic Small Outline, Body 1.6 x 2.9 mm, Pitch 0.65 mm
U6 = CMP-0323-00124-3: Buck Step Down Regulator with 3 to 17 V Input and 1.8 V Output, -40 to 85 degC, 16-Pin QFN (RGT), Green (RoHS & no Sb/Br); Manufacturer: Texas Instruments; Vin(Min)(V): 3; Duty Cycle(Max)(%): 90; SubFamily: Step-Down Regulator; Iq(Typ)(mA): 0.017; Regulated Outputs(#): 1; Vout(Max)(V): 1.8; Switch Current Limit(Typ)(A): 1.7; Synchronous Rectification: TRUE; Vin(Max)(V): 17; Rating: Catalog; ComponentLink2Description: Package Specification; ComponentLink2URL: http://www.ti.com/litv/pdf/mpqf119g; Code_JEDEC: MO-220; DatasheetVersion: SLVSAL5; Mounting Technology: Surface Mount; PartNumber: TPS62151RGTT; ComponentLink1Description: Datasheet; Eco-Plan: Green (RoHS & no Sb/Br); ComponentLink1URL: http://www.ti.com/general/docs/lit/getliterature.tsp?genericPartNumber=TPS62151&fileType=pdf; Iout(Max)(A): 1; PackageDescription: 16-Pin Plastic Quad Flat No-Lead, 3 x 3 mm Body, 0.5 mm Pitch, 1.7 x 1.7 mm Exposed Pad; ComponentLink3Description: URL Link1; Topology: Buck; ComponentLink3URL: Samples URL:http://www.ti.com/product/tps54611#samples; PackageVersion: revH, Oct-2011; Vout(Min)(V): 1.8; Preset Vout(V): 1.8; PackageReference: RGT0016C
U2 = SCH - POWER - EFUSE - TPS25942A: Supplier 1: Digi-Key